# EAGLE design EMG-single (EAGLE 7.1.0)
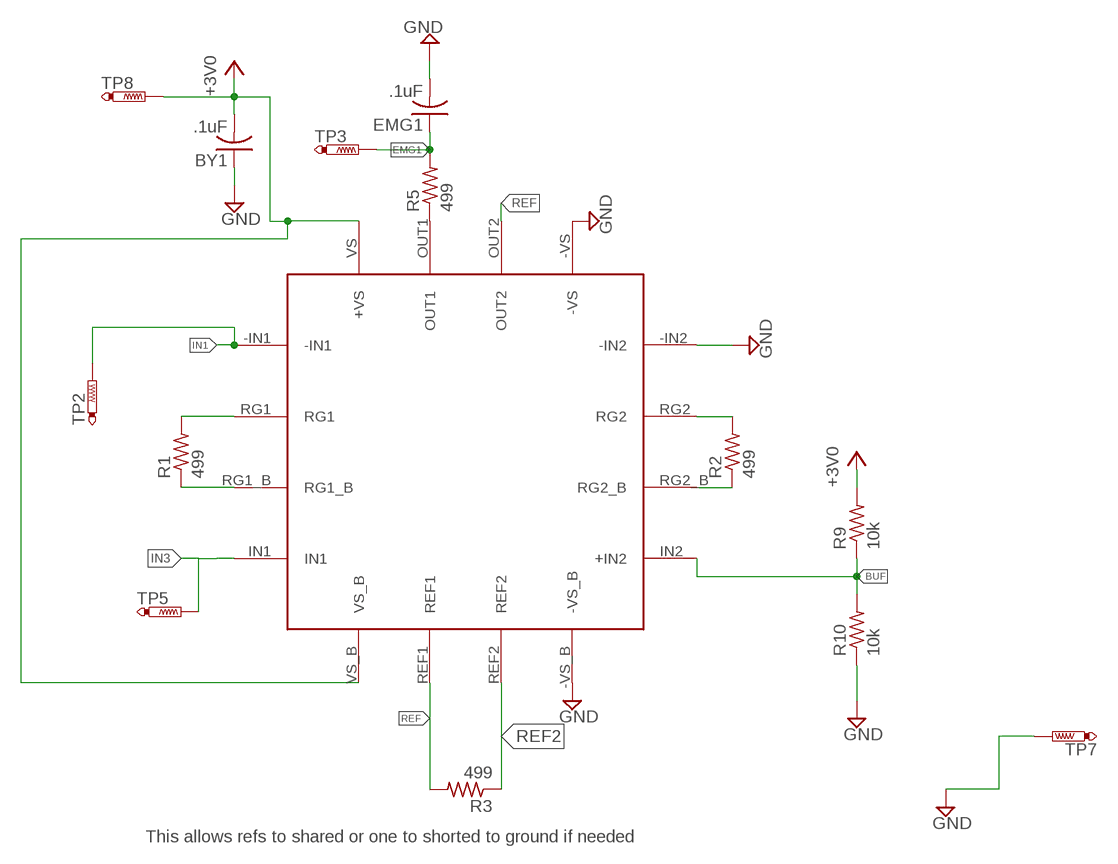
[diagram p0: schematic, sheet 1]

## Parts
BY1  .1uF  C-USC0805  [C0805]
EMG1  .1uF  C-USC0805  [C0805]
R1  499  R-US_R0805  [R0805]
R2  499  R-US_R0805  [R0805]
R3  499  R-US_R0805  [R0805]
R5  499  R-US_R0805  [R0805]
R9  10k  R-US_R0805  [R0805]
R10  10k  R-US_R0805  [R0805]
TP2  PTR1TP20SQ  [TP20SQ]
TP3  PTR1TP20SQ  [TP20SQ]
TP5  PTR1TP20SQ  [TP20SQ]
TP7  PTR1TP20SQ  [TP20SQ]
TP8  PTR1TP20SQ  [TP20SQ]
U$9  AD8222  [QFN-16]

## Nets
+3V0: BY1.2 R9.2 TP8.TP U$9.VS(+VS) U$9.VS_B
BUF: R9.1 R10.2 U$9.IN2(+IN2)
EMG1: EMG1.1 R5.2 TP3.TP
GND: BY1.1 EMG1.2 R10.1 TP7.TP U$9.-IN2 U$9.-VS U$9.-VS_B
IN1: TP2.TP U$9.-IN1
IN3: TP5.TP U$9.IN1
N$1: R1.2 U$9.RG1
N$2: R1.1 U$9.RG1_B
N$3: R2.2 U$9.RG2
N$5: R2.1 U$9.RG2_B
N$10: R5.1 U$9.OUT1
REF: R3.2 U$9.OUT2 U$9.REF1
REF2: R3.1 U$9.REF2

## Notes on the sheet
- This allows refs to shared or one to shorted to ground if needed

## Library data of the parts
BY1 EMG1 = adafruit:C-US: CAPACITOR, American symbol
R1-R3 R5 R9 R10 = adafruit:R-US_: RESISTOR, American symbol
TP2 TP3 TP5 TP7 TP8 = testpad:PTR1: TEST PIN
U$9 = kushal:AD8222

## Board
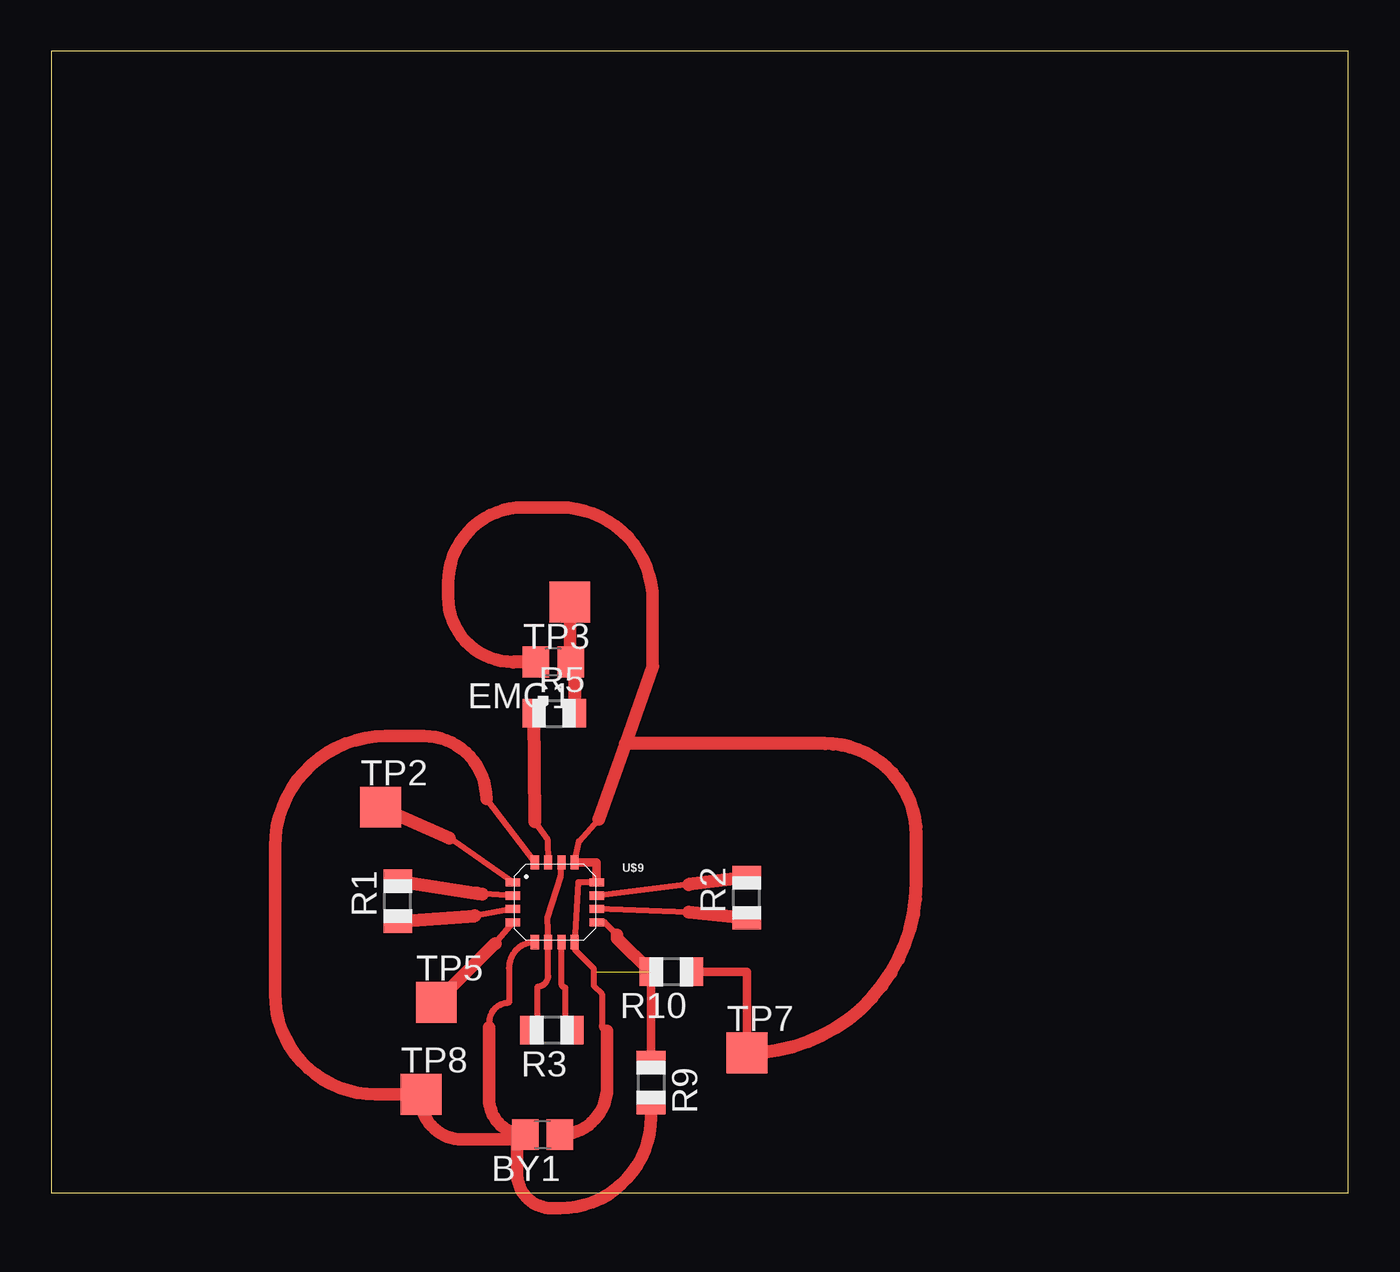
[diagram p1: board, top side]

Size 63.5 x 55.88 mm. Coordinates in mm from the lower left corner, seen from the top.
Outline: 0,0 63.5,0 63.5,55.88 0,55.88 0,0
Copper layers (1*16): Top 0.035mm / dielectric 1.5mm / Bottom 0.035mm
Design rules "4pcb": minimum track width 8mil, minimum drill 10mil, track to track 8mil, track to pad 8mil, pad to pad 8mil, via to via 8mil, smd to smd 8mil, copper to edge 10mil, drill to drill 8mil, minimum pad ring 10mil, minimum via ring 8mil, stop-mask expansion 4mil, vias tented up to drill 0mil, thermal gap 10mil

### Footprints (pad centres in the part's own frame; a part is rotated, then mirrored left to right if it is on the bottom)
C0805 = smd 1.3 x 1.5: 1 -0.85,0; 2 0.85,0
R0805 = smd 1.1 x 1.4: 1 -1,0; 2 1,0
TP20SQ = smd 2 x 2: TP 0,0
QFN-16 = smd 0.7 x 0.4: -IN1 -2.05,0.975; -IN2 2.05,0.975; IN1 -2.05,-0.975; IN2 2.05,-0.975; RG1 -2.05,0.325; RG1_B -2.05,-0.325; RG2 2.05,0.325; RG2_B 2.05,-0.325 | smd 0.4 x 0.7: -VS 0.975,1.95; -VS_B 0.975,-1.95; OUT1 -0.325,1.95; OUT2 0.325,1.95; REF1 -0.325,-1.95; REF2 0.325,-1.95; VS -0.975,1.95; VS_B -0.975,-1.95

### Placement (x,y rotation side)
BY1  24.06,2.84 180 top
EMG1  24.58,25.98 180 top
R1  16.97,14.27 90 top
R2  34.05,14.44 90 top
R3  24.51,7.95 180 top
R5  24.63,23.46 0 top
R9  29.36,5.39 270 top
R10  30.36,10.81 180 top
TP2  16.13,18.87 0 top
TP3  25.39,28.92 180 top
TP5  18.85,9.31 0 top
TP7  34.06,6.85 0 top
TP8  18.11,4.81 0 top
U$9  24.65,14.21 0 top

### Tracks (layer width: path | path; a pad name or v marks a point on that pad's centre or on a via)
+3V0
  Top 0.305: U$9.VS 21.31,19.28 | U$9.VS_B arc90 22.42,11 22.42,9.29 arc90 21.43,8.31 21.43,8.09
  Top 0.61: 17.86,4.81 15.89,4.81 arc-90 10.96,9.75 10.96,16.93 arc-90 16.38,22.35 18.24,22.35 arc-90 21.31,19.28 | TP8.TP 18.11,4.62 arc90 20.12,2.61 22.97,2.61 arc90 BY1.2 | R9.2 29.36,3.71 arc-90 24.9,-0.76 24.52,-0.76 arc-90 22.81,0.95 22.81,2.44 arc-90 BY1.2 | BY1.2 arc-90 21.43,4.61 21.43,8.09
  Top 0.635: TP8.TP 17.86,4.81
BUF  (1 unrouted)
  Top 0.305: U$9.IN2 27.1,13.24 27.71,12.63
  Top 0.406: R10.2 29.36,8.48 R9.1
  Top 0.61: 27.71,12.63 27.71,12.46 R10.2
EMG1
  Top 0.61: TP3.TP 25.39,25.67 arc90 25.62,25.43
  Top 0.635: 25.43,26.05 EMG1.1 25.62,25.98 25.62,25.43 R5.2
GND
  Top 0.305: U$9.-VS 25.83,17.2 26.81,18.28 | U$9.-IN2 25.79,15.19 U$9.-VS_B 25.63,11.91 26.56,10.98 26.56,10.13 26.96,9.73 26.96,8.17 arc90 27.21,7.92
  Top 0.406: U$9.-VS 26.7,16.16 U$9.-IN2 | R10.1 34.06,10.81 TP7.TP
  Top 0.61: 29.45,25.76 29.45,28.98 arc90 24.88,33.55 23.13,33.55 arc90 19.44,29.85 19.44,29.16 arc90 22.62,25.98 | BY1.1 arc90 27.21,5.14 27.21,7.92
  Top 0.635: EMG1.2 22.62,25.98 | 29.45,25.76 28.11,21.98 | 28.11,21.98 26.81,18.28 | TP7.TP arc90 42.35,15.14 42.35,17.51 arc90 37.88,21.98 28.11,21.98
IN1
  Top 0.305: U$9.-IN1 19.5,17.36
  Top 0.635: TP2.TP 19.5,17.36
IN3
  Top 0.305: 21.74,12.19 U$9.IN1
  Top 0.635: TP5.TP 21.74,12.19
N$1
  Top 0.305: U$9.RG1 20.87,14.66
  Top 0.635: R1.2 20.87,14.66 21.11,14.62
N$2
  Top 0.305: U$9.RG1_B 20.75,13.56
  Top 0.635: R1.1 20.75,13.56
N$3
  Top 0.305: 31.21,15.09 U$9.RG2
  Top 0.635: R2.2 31.21,15.09
N$5
  Top 0.305: 31.2,13.72 U$9.RG2_B
  Top 0.635: R2.1 31.2,13.72
N$10
  Top 0.305: 23.68,18.16 24.3,17.3 U$9.OUT1
  Top 0.635: R5.1 23.68,18.16
REF
  Top 0.305: U$9.OUT2 24.93,16.16 24.93,15.5 24.29,13.44 U$9.REF1 24.33,10.61 arc-90 23.82,10.09 23.82,8.26 arc-90 R3.2
REF2
  Top 0.305: R3.1 arc-90 25.18,8.29 25.18,10.04 arc-90 24.98,10.24 U$9.REF2